# Altium project TivaEthernet.PrjPCB
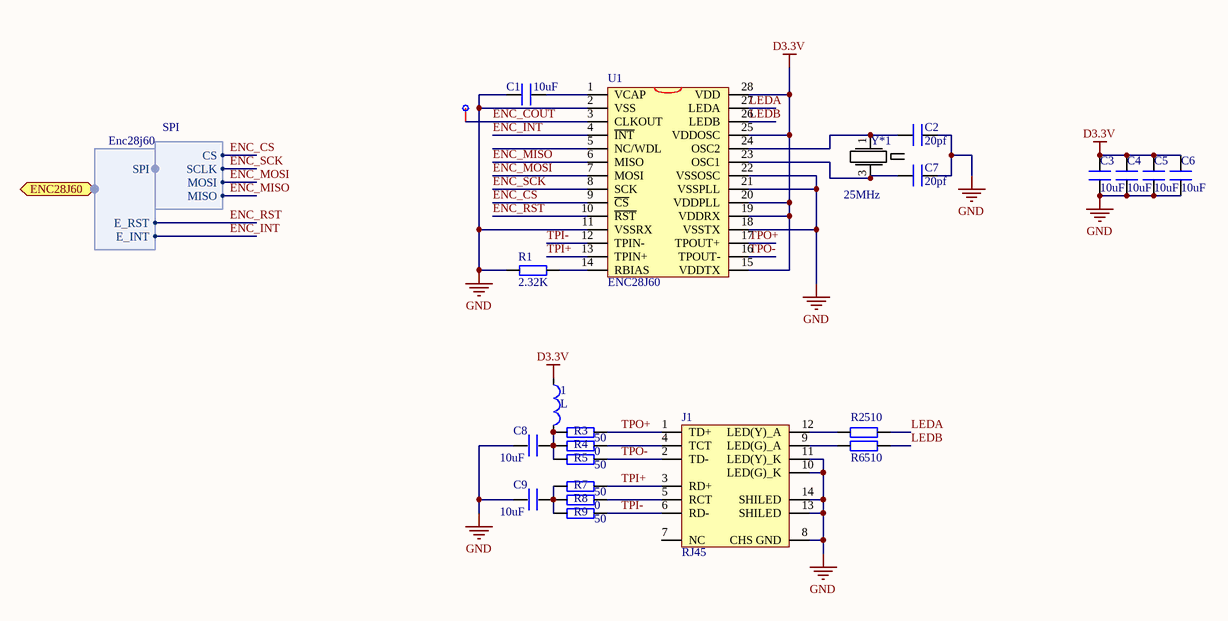
[diagram p0: Enc28j60.SchDoc]
1 sheet, 23 parts. Net scope: global (net labels, ports and power ports of the same name join across sheets).
Board file: TivaEthernet.PcbDoc

## Sheet Enc28j60.SchDoc
size A4

### Parts
1  L  [0805]
*1  Point  [Point]  (value not drawn)
C1  10uF  [0805]
C2  20pf  [0603P]
C3  10uF  [0603P]
C4  10uF  [0603P]
C5  10uF  [0603P]
C6  10uF  [0603P]
C7  20pf  [0603P]
C8  10uF  [0603P]
C9  10uF  [0603P]
J1  RJ45  [HR911105A]
R1  2.32K  [0603P]
R2  510  [0603P]
R3  50  [0603P]
R4  0  [0603P]
R5  50  [0603P]
R6  510  [0603P]
R7  50  [0603P]
R8  0  [0603P]
R9  50  [0603P]
U1  ENC28J60  [SSOP28]
Y*1  25MHz  [4脚晶振]

### Ports
ENC28J60 (harness Enc28j60)

### Harnesses
Enc28j60: SPI, E_RST, E_INT
SPI: CS, SCLK, MOSI, MISO

### Nets
D3.3V: 1.2 C3.2 C4.2 C5.2 C6.2 U1.15(VDDTX) U1.19(VDDRX) U1.20(VDDPLL) U1.25(VDDOSC) U1.28(VDD)
GND: C1.1 C2.2 C3.1 C4.1 C5.1 C6.1 C7.2 C8.1 C9.1 J1.8(CHS_GND) J1.10(LED(G)_K) J1.11(LED(Y)_K) J1.13(SHILED) J1.14(SHILED) R1.1 U1.2(VSS) U1.11(VSSRX) U1.18(VSSTX) U1.21(VSSPLL) U1.22(VSSOSC)
ENC_COUT: *1.1(Point) U1.3(CLKOUT)
ENC_CS: U1.9(~{CS}) ; harness SPI.CS
ENC_INT: U1.4(~{INT}) ; port ENC28J60.E_INT
ENC_MISO: U1.6(MISO) ; harness SPI.MISO
ENC_MOSI: U1.7(MOSI) ; harness SPI.MOSI
ENC_RST: U1.10(~{RST}) ; port ENC28J60.E_RST
ENC_SCK: U1.8(SCK) ; harness SPI.SCLK
LEDA: R2.2 U1.27(LEDA)
LEDB: R6.2 U1.26(LEDB)
TPI+: J1.3(RD+) R7.2 U1.13(TPIN+)
TPI-: J1.6(RD-) R9.2 U1.12(TPIN-)
TPO+: J1.1(TD+) R3.2 U1.17(TPOUT+)
TPO-: J1.2(TD-) R5.2 U1.16(TPOUT-)
Net1_1: 1.1 C8.2 R3.1 R4.1 R5.1
NetC1_2: C1.2 U1.1(VCAP)
NetC2_1: C2.1 U1.24(OSC2) Y*1.1(O)
NetC7_1: C7.1 U1.23(OSC1) Y*1.3(O)
NetC9_2: C9.2 R7.1 R8.1 R9.1
NetJ1_4: J1.4(TCT) R4.2
NetJ1_5: J1.5(RCT) R8.2
NetJ1_9: J1.9(LED(G)_A) R6.1
NetJ1_12: J1.12(LED(Y)_A) R2.1
NetR1_2: R1.2 U1.14(RBIAS)

Not connected (* = marked no-connect by the designer): J1 7(NC); U1 5(NC/WDL); Y*1 2(G) 4(G)

### Library data of the parts
C1-C9 = C
J1 = HR911105
R1-R9 = R
Y*1 = XTAL_16M